# Altium schematic sheet 14_LMS1_RF_PA.SchDoc: LMS1 RF PA
size A3; Organization: Lime Microsystems; Address1: Surrey Tech Centre; Address2: Guildford GU2 7YG; Address3: Surrey; Address4: United Kingdom; Revision: v1.0; SheetNumber: 14; SheetTotal: 31
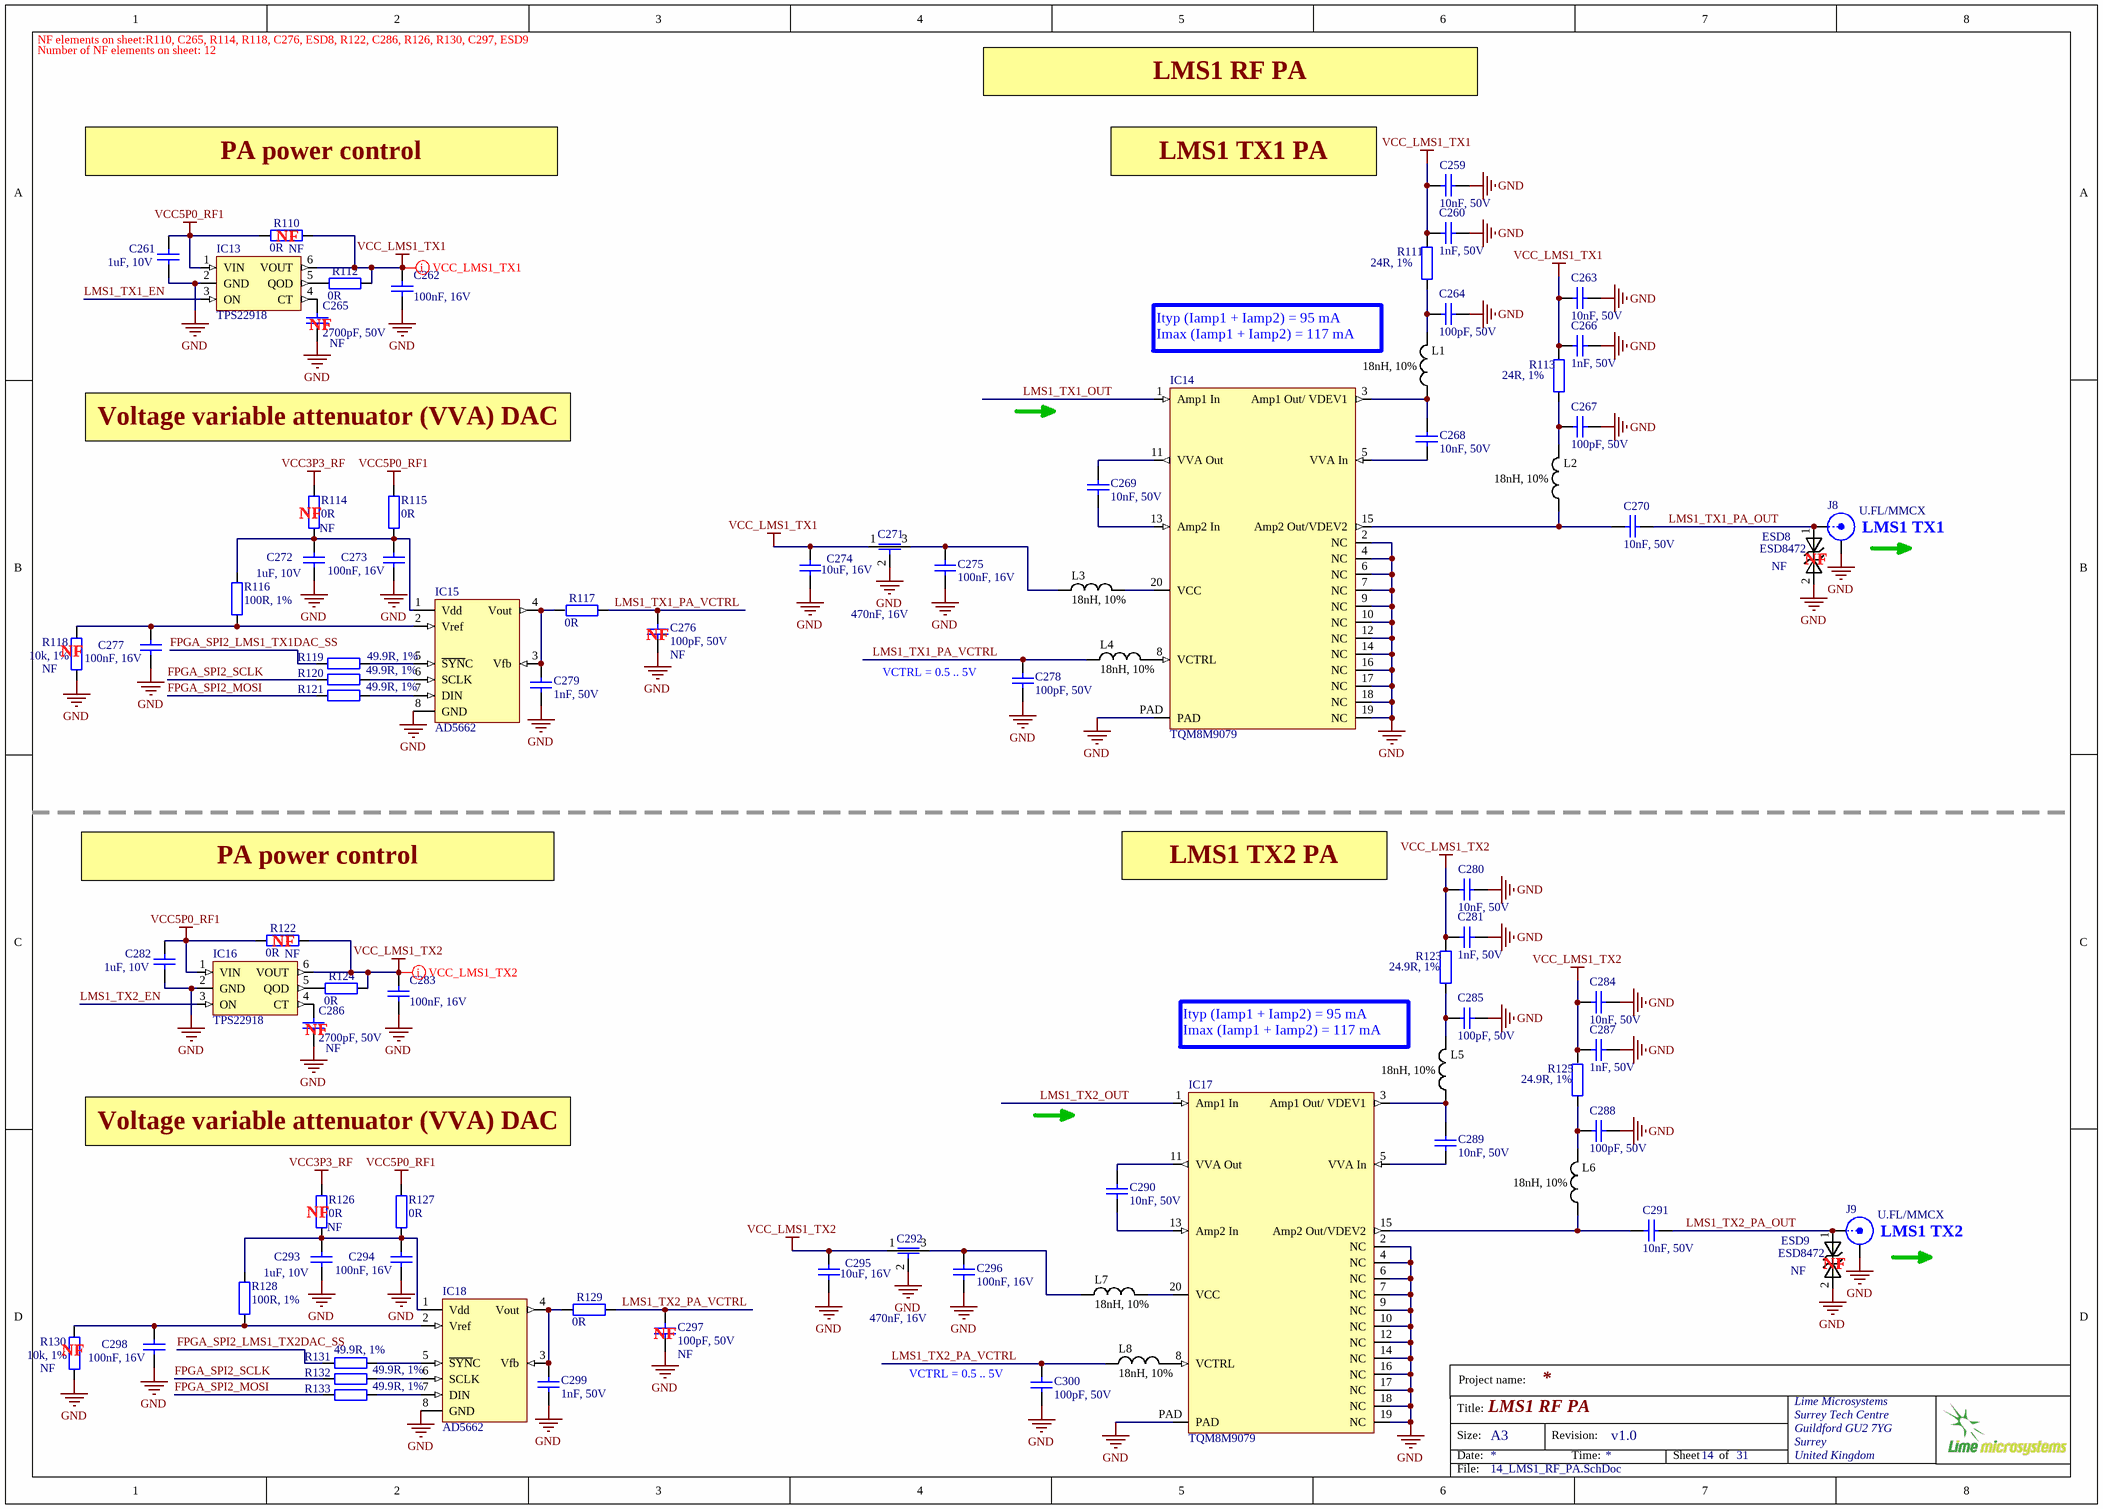
[diagram p0: 14_LMS1_RF_PA.SchDoc]

## Parts
C259  10nF, 50V  [CAP0402]
C260  1nF, 50V  [CAP0402]
C261  1uF, 10V  [CAP0402]
C262  100nF, 16V  [CAP0402]
C263  10nF, 50V  [CAP0402]
C264  100pF, 50V  [CAP0402]
C265  2700pF, 50V  Assembly Info: NF  [CAP0402]
C266  1nF, 50V  [CAP0402]
C267  100pF, 50V  [CAP0402]
C268  10nF, 50V  [CAP0402]
C269  10nF, 50V  [CAP0402]
C270  10nF, 50V  [CAP0402]
C271  470nF, 16V  [CAP0805_FEEDTHROUGH]
C272  1uF, 10V  [CAP0402]
C273  100nF, 16V  [CAP0402]
C274  10uF, 16V  [CAP0603]
C275  100nF, 16V  [CAP0402]
C276  100pF, 50V  Assembly Info: NF  [CAP0402]
C277  100nF, 16V  [CAP0402]
C278  100pF, 50V  [CAP0402]
C279  1nF, 50V  [CAP0402]
C280  10nF, 50V  [CAP0402]
C281  1nF, 50V  [CAP0402]
C282  1uF, 10V  [CAP0402]
C283  100nF, 16V  [CAP0402]
C284  10nF, 50V  [CAP0402]
C285  100pF, 50V  [CAP0402]
C286  2700pF, 50V  Assembly Info: NF  [CAP0402]
C287  1nF, 50V  [CAP0402]
C288  100pF, 50V  [CAP0402]
C289  10nF, 50V  [CAP0402]
C290  10nF, 50V  [CAP0402]
C291  10nF, 50V  [CAP0402]
C292  470nF, 16V  [CAP0805_FEEDTHROUGH]
C293  1uF, 10V  [CAP0402]
C294  100nF, 16V  [CAP0402]
C295  10uF, 16V  [CAP0603]
C296  100nF, 16V  [CAP0402]
C297  100pF, 50V  Assembly Info: NF  [CAP0402]
C298  100nF, 16V  [CAP0402]
C299  1nF, 50V  [CAP0402]
C300  100pF, 50V  [CAP0402]
ESD8  ESD8472  Assembly Info: NF  [ESD8472_X3DFN2]
ESD9  ESD8472  Assembly Info: NF  [ESD8472_X3DFN2]
IC13  TPS22918  [SOT23-6]
IC14  TQM8M9079  [TQM8M9079]
IC15  AD5662  [AD5662_SOT23-8]
IC16  TPS22918  [SOT23-6]
IC17  TQM8M9079  [TQM8M9079]
IC18  AD5662  [AD5662_SOT23-8]
J8  U.FL/MMCX  [MMCX_UFL_conn_m]
J9  U.FL/MMCX  [MMCX_UFL_conn_m]
L1  18nH, 10%  [RES0603]
L2  18nH, 10%  [RES0603]
L3  18nH, 10%  [RES0603]
L4  18nH, 10%  [RES0603]
L5  18nH, 10%  [RES0603]
L6  18nH, 10%  [RES0603]
L7  18nH, 10%  [RES0603]
L8  18nH, 10%  [RES0603]
R110  0R  Assembly Info: NF  [RES0402]
R111  24R, 1%  [RES0402]
R112  0R  [RES0402]
R113  24R, 1%  [RES0402]
R114  0R  Assembly Info: NF  [RES0402]
R115  0R  [RES0402]
R116  100R, 1%  [RES0402]
R117  0R  [RES0402]
R118  10k, 1%  Assembly Info: NF  [RES0402]
R119  49.9R, 1%  [RES0402]
R120  49.9R, 1%  [RES0402]
R121  49.9R, 1%  [RES0402]
R122  0R  Assembly Info: NF  [RES0402]
R123  24.9R, 1%  [RES0402]
R124  0R  [RES0402]
R125  24.9R, 1%  [RES0402]
R126  0R  Assembly Info: NF  [RES0402]
R127  0R  [RES0402]
R128  100R, 1%  [RES0402]
R129  0R  [RES0402]
R130  10k, 1%  Assembly Info: NF  [RES0402]
R131  49.9R, 1%  [RES0402]
R132  49.9R, 1%  [RES0402]
R133  49.9R, 1%  [RES0402]

## Nets
GND: C259.2 C260.1 C261.1 C262.1 C263.2 C264.1 C265.2 C266.1 C267.1 C271.2 C272.1 C273.2 C274.1 C275.2 C276.2 C277.2 C278.2 C279.2 C280.2 C281.1 C282.1 C283.1 C284.2 C285.1 C286.2 C287.1 C288.1 C292.2 C293.1 C294.2 C295.1 C296.2 C297.2 C298.2 C299.2 C300.2 ESD8.2 ESD9.2 IC13.2(GND) IC14.2(NC) IC14.4(NC) IC14.6(NC) IC14.7(NC) IC14.9(NC) IC14.10(NC) IC14.12(NC) IC14.14(NC) IC14.16(NC) IC14.17(NC) IC14.18(NC) IC14.19(NC) IC14.PAD IC15.8(GND) IC16.2(GND) IC17.2(NC) IC17.4(NC) IC17.6(NC) IC17.7(NC) IC17.9(NC) IC17.10(NC) IC17.12(NC) IC17.14(NC) IC17.16(NC) IC17.17(NC) IC17.18(NC) IC17.19(NC) IC17.PAD IC18.8(GND) J8.2(Y) J9.2(Y) R118.1 R130.1
VCC3P3_RF: R114.2 R126.2
VCC5P0_RF1: C261.2 C282.2 IC13.1(VIN) IC16.1(VIN) R110.2 R115.2 R122.2 R127.2
VCC_LMS1_TX1: C259.1 C260.2 C262.2 C263.1 C266.2 C271.1 C274.2 IC13.6(VOUT) R110.1 R111.2 R112.1 R113.2
VCC_LMS1_TX2: C280.1 C281.2 C283.2 C284.1 C287.2 C292.1 C295.2 IC16.6(VOUT) R122.1 R123.2 R124.1 R125.2
FPGA_SPI2_LMS1_TX1DAC_SS: R119.2
FPGA_SPI2_LMS1_TX2DAC_SS: R131.2
FPGA_SPI2_MOSI: R121.2 R133.2
FPGA_SPI2_SCLK: R120.2 R132.2
LMS1_TX1_EN: IC13.3(ON)
LMS1_TX1_OUT: IC14.1(Amp1_In)
LMS1_TX1_PA_OUT: C270.2 ESD8.1 J8.1(X)
LMS1_TX1_PA_VCTRL: C276.1 C278.1 L4.2 R117.1
LMS1_TX2_EN: IC16.3(ON)
LMS1_TX2_OUT: IC17.1(Amp1_In)
LMS1_TX2_PA_OUT: C291.2 ESD9.1 J9.1(X)
LMS1_TX2_PA_VCTRL: C297.1 C300.1 L8.2 R129.1
NetC264_2: C264.2 L1.1 R111.1
NetC265_1: C265.1 IC13.4(CT)
NetC267_2: C267.2 L2.1 R113.1
NetC268_1: C268.1 IC14.5(VVA_In)
NetC268_2: C268.2 IC14.3(Amp1_Out/_VDEV1) L1.2
NetC269_1: C269.1 IC14.13(Amp2_In)
NetC269_2: C269.2 IC14.11(VVA_Out)
NetC270_1: C270.1 IC14.15(Amp2_Out/VDEV2) L2.2
NetC271_3: C271.3 C275.1 L3.2
NetC272_2: C272.2 C273.1 IC15.1(Vdd) R114.1 R115.1 R116.1
NetC277_1: C277.1 IC15.2(Vref) R116.2 R118.2
NetC279_1: C279.1 IC15.3(Vfb) IC15.4(Vout) R117.2
NetC285_2: C285.2 L5.1 R123.1
NetC286_1: C286.1 IC16.4(CT)
NetC288_2: C288.2 L6.1 R125.1
NetC289_1: C289.1 IC17.5(VVA_In)
NetC289_2: C289.2 IC17.3(Amp1_Out/_VDEV1) L5.2
NetC290_1: C290.1 IC17.13(Amp2_In)
NetC290_2: C290.2 IC17.11(VVA_Out)
NetC291_1: C291.1 IC17.15(Amp2_Out/VDEV2) L6.2
NetC292_3: C292.3 C296.1 L7.2
NetC293_2: C293.2 C294.1 IC18.1(Vdd) R126.1 R127.1 R128.1
NetC298_1: C298.1 IC18.2(Vref) R128.2 R130.2
NetC299_1: C299.1 IC18.3(Vfb) IC18.4(Vout) R129.2
NetIC13_5: IC13.5(QOD) R112.2
NetIC14_8: IC14.8(VCTRL) L4.1
NetIC14_20: IC14.20(VCC) L3.1
NetIC15_5: IC15.5(~{SYN}C) R119.1
NetIC15_6: IC15.6(SCLK) R120.1
NetIC15_7: IC15.7(DIN) R121.1
NetIC16_5: IC16.5(QOD) R124.2
NetIC17_8: IC17.8(VCTRL) L8.1
NetIC17_20: IC17.20(VCC) L7.1
NetIC18_5: IC18.5(~{SYN}C) R131.1
NetIC18_6: IC18.6(SCLK) R132.1
NetIC18_7: IC18.7(DIN) R133.1

## Layout directives
net class VCC_LMS1_TX1: VCC_LMS1_TX1
net class VCC_LMS2_TX1_2: VCC_LMS1_TX2

## Notes on the sheet
- NF elements on sheet:R110, C265, R114, R118, C276, ESD8, R122, C286, R126, R130, C297, ESD9
- Number of NF elements on sheet: 12
- LMS1 RF PA
- PA power control
- LMS1 TX1 PA
- (near R110) NF
- (near C265) NF
- Ityp (Iamp1 + Iamp2) = 95 mA
  Imax (Iamp1 + Iamp2) = 117 mA
- Voltage variable attenuator (VVA) DAC
- (near R114) NF
- (near ESD8) NF
- (near J8) LMS1 TX1
- (near C276) NF
- (near R118) NF
- (near C278) VCTRL = 0.5 .. 5V
- LMS1 TX2 PA
- (near R122) NF
- (near C286) NF
- (near R126) NF
- (near J9) LMS1 TX2
- (near ESD9) NF
- (near R130) NF
- (near C297) NF
- (near C300) VCTRL = 0.5 .. 5V
- Project name:
- Title:
- Size:
- Date:
- A3
- Revision:
- Time:
- Sheet
- of
- File:

## Library data of the parts
C259 C263 C268-C270 C280 C284 C289-C291 = Cap_0402: Part Description: 10000pF ±10% 50V Ceramic Capacitor X7R 0402 (1005 Metric); Manufacturer: Murata Electronics North America; Manufacturer Part Number 1: GRM155R71H103KA88D; Tolerance: ±10%; Temperature Coefficient: X7R; Value: 10nF, 50V; Supplier 1: Digi-Key; Supplier Part Number 1: 490-4516-2-ND; RoHS: RoHS Compliant; Category: Capacitors; Stock 1: 10970000; Pricing 1: 10000=0.00185, 20000=0.00176, 30000=0.00167 (USD); Packaging: Tape & Reel (TR); Part Status: Active; Voltage - Rated: 50V; Operating Temperature: -55°C ~ 125°C; Features: -; Ratings: -; Applications: General Purpose; Mounting Type: Surface Mount, MLCC; Package / Case: 0402 (1005 Metric); Size / Dimension: 0.039" L x 0.020" W (1.00mm x 0.50mm); Height - Seated (Max): -; Thickness (Max): 0.022" (0.55mm); Lead Spacing: -; Lead Style: -; ComponentLink1URL: http://www.murata.com/~/media/webrenewal/support/library/catalog/products/capacitor/mlcc/c02e.ashx?la=en-us; ComponentLink1Description: http://www.murata.com/~/media/webrenewal/support/library/catalog/products/capacitor/mlcc/c02e.ashx?la=en-us
C260 C266 C281 C287 = Cap_0402: Manufacturer Part Number 1: GCM155R71H102KA37D; Part Description: 1000pF ±10% 50V X7R Ceramic Capacitor -55°C ~ 125°C Surface Mount, MLCC 0402 (1005 Metric) 0.039" L x 0.020" W (1.00mm x 0.50mm); Capacitance: 1000 pF; Type: Automotive Ultra Small MLCC; Tolerance: 10 %; Brand: Murata Electronics; Case Height: 0.5 mm; Case Length: 1 mm; Dielectric: X7R; Temperature Coefficient / Code: +/- 15 %; Value: 1nF, 50V; Supplier 1: Mouser; Supplier Part Number 1: 81-GCM155R71H102KA7D; Case Code - in: 0402; Package / Case: 0402 (1005 metric); Termination Style: SMD/SMT; Packaging: Reel; Operating Temperature Range: - 55 C to + 125 C; Maximum Operating Temperature: + 125 C; Manufacturer: Murata Electronics; Category: Multilayer Ceramic Capacitors MLCC - SMD/SMT; RoHS: RoHS Compliant; Series: GCM; Case Width: 0.5 mm; Voltage Rating DC: 50 V; Case Code - mm: 1005; Product: Automotive MLCCs; Standard Pack Qty: 10000; Reeling: True; RoHS - Mouser: Y; Minimum Order Quantity: 1; Product Category: Automotive Ceramic Chip Capacitors; Minimum Operating Temperature: - 55 C
C261 C272 C282 C293 = Cap_0402: Manufacturer Part Number 1: C1005X5R1E105K050BC; Manufacturer: TDK; Part Description: 1µF ±10% 10V X5R Ceramic Capacitor -55°C ~ 85°C Surface Mount, MLCC 0402 (1005 Metric) 0.039" L x 0.020" W (1.00mm x 0.50mm); Voltage Rating: 10; Capacitance Tolerance: ± 10%; Product Range: TDK - C Series; Ceramic Capacitor Case: 0402 [1005 Metric]; Capacitance: 1; Dielectric Characteristic: X6; Value: 1uF, 10V; Supplier 1: Digi-Key; Supplier Part Number 1: 445-9066-1-ND; MSL: -; RoHS: YES
C262 C275 C283 C296 = Cap_0402: Manufacturer: Murata Electronics; Manufacturer Part Number 1: GRM155R71C104KA88D; Part Description: 0.10µF ±10% 16V X7R Ceramic Capacitor -55°C ~ 125°C Surface Mount, MLCC 0402 (1005 Metric) 0.039" L x 0.020" W (1.00mm x 0.50mm); Tolerance: 10 %; Type: General Purpose MLCC; Capacitance: 0.1 uF; Case Length: 1 mm; Dielectric: X7R; Case Height: 0.5 mm; Temperature Coefficient / Code: +/- 15 %; Value: 100nF, 16V; Supplier 1: Mouser; Supplier Part Number 1: 81-GRM155R71C104KA88; Case Code - in: 0402; RoHS: RoHS Compliant; Operating Temperature Range: - 55 C to + 125 C; Series: GRM; Termination Style: SMD/SMT; Package / Case: 0402 (1005 metric); Voltage Rating DC: 16 V; Maximum Operating Temperature: + 125 C; Case Code - mm: 1005; Minimum Operating Temperature: - 55 C; Product Category: Low & Medium Capacitance SMD Ceramic Chip Capacitors; Packaging: Reel; Product: General Type MLCCs; Category: Multilayer Ceramic Capacitors MLCC - SMD/SMT; Brand: Murata Electronics; Case Width: 0.5 mm; RoHS - Mouser: Y; Standard Pack Qty: 10000; Minimum Order Quantity: 1; Reeling: True
C264 C267 C276 C278 C285 C288 C297 C300 = Cap_0402: Manufacturer Part Number 1: CC0402JRNPO9BN101; Manufacturer: Yageo; Part Description: 100pF ±5% 50V C0G, NP0 Ceramic Capacitor -55°C ~ 125°C Surface Mount, MLCC 0402 (1005 Metric) 0.039" L x 0.020" W (1.00mm x 0.50mm); Tolerance: ±5%; Temperature Coefficient: C0G, NP0; Value: 100pF, 50V; Capacitance: 100pF; Thickness (Max): 0.022" (0.55mm); Size / Dimension: 0.039" L x 0.020" W (1.00mm x 0.50mm); RoHS: RoHS Compliant; Ratings: -; Package / Case: 0402 (1005 Metric); Mounting Type: Surface Mount, MLCC; Height - Seated (Max): -; Features: -; Lead Spacing: -; Voltage - Rated: 50V; Operating Temperature: -55°C ~ 125°C; Packaging: Cut Tape (CT); Applications: General Purpose; Lead Style: -; Supplier 1: Digi-Key; Category: Capacitors; Supplier Part Number 1: 311-1024-1-ND
C265 C286 = Cap_0402: Manufacturer Part Number 1: GRM155R71H272KA01J; Manufacturer: Murata Electronics North America; Part Description: 2700pF ±10% 50V Ceramic Capacitor X7R 0402 (1005 Metric); Notification: Current market demand for these product types have resulted in fluctuating and extending lead times. Lead times may differ.; Tolerance: ±10%; Temperature Coefficient: X7R; Value: 2700pF, 50V; Size / Dimension: 0.039" L x 0.020" W (1.00mm x 0.50mm); Supplier 1: Digi-Key; Height - Seated (Max): -; Package / Case: 0402 (1005 Metric); Supplier Part Number 1: 490-6361-1-ND; Part Status: Active; RoHS: RoHS Compliant; Operating Temperature: -55°C ~ 125°C; Category: Capacitors; Ratings: -; Features: -; Packaging: Cut Tape (CT); Mounting Type: Surface Mount, MLCC; Voltage - Rated: 50V; Lead Spacing: -; Thickness (Max): 0.022" (0.55mm); Applications: General Purpose
C271 C292 = Cap_feed_through: Part Description: 0.47µF Feed Through Capacitor 16V 2A 30mOhm 0805 (2012 Metric), 3 PC Pad; Manufacturer: Murata; Manufacturer Part Number 1: NFM21PC474R1C3D; Max Current Rating: 2A; Tolerance: 20%; DC Resistance (DCR): 30mR; Insulation Resistance: 1GR; Value: 470nF, 16V; Supplier 1: Digi-Key; Supplier Part Number 1: 490-2537-1-ND; Stock 1: 220606; Pricing 1: 1=0,25000, 10=0,22900, 25=0,21840, 50=0,21160, 100=0,20450, 250=0,19392, 500=0,16218, 1000=0,12586 (USD); Mount: Surface Mount,PCB; Case/Package: 0805; Weight: 0.000194oz; Case Code (Metric): 2012; Case Code (Imperial): 0805; Min Operating Temperature: -55°C; Max Operating Temperature: 125°C; Package Quantity: 1; Capacitance: 470nF; Packaging: Tape and Reel; Max Voltage Rating (DC): 16V; Current Rating: 2A; Voltage Rating: 16V; Voltage Rating (DC): 16V; Voltage: 16V; Current: 2A; Termination: Flat; Length: 2mm; Height: 0.85mm; Width: 1.25mm; Depth: 1.25mm; Radiation Hardening: No; REACH SVHC: No SVHC; Lead Free: Lead Free; RoHS: Yes
C273 C277 C294 C298 = Cap_0603: Manufacturer Part Number 1: GRM155R71C104KA88D; Part Description: 0.10µF ±10% 16V X7R Ceramic Capacitor -55°C ~ 125°C Surface Mount, MLCC 0402 (1005 Metric) 0.039" L x 0.020" W (1.00mm x 0.50mm); Brand: Murata Electronics; Tolerance: 10 %; Type: General Purpose MLCC; Capacitance: 0.1 uF; Temperature Coefficient / Code: +/- 15 %; Case Height: 0.5 mm; Case Length: 1 mm; Dielectric: X7R; Supplier 1: Mouser; Supplier Part Number 1: 81-GRM155R71C104KA88; Case Code - in: 0402; Manufacturer: Murata Electronics; Category: Multilayer Ceramic Capacitors MLCC - SMD/SMT; Voltage Rating DC: 16 V; Value: 100nF, 16V; Case Code - mm: 1005; Case Width: 0.5 mm; Maximum Operating Temperature: + 125 C; Minimum Operating Temperature: - 55 C; Minimum Order Quantity: 1; Operating Temperature Range: - 55 C to + 125 C; Package / Case: 0402 (1005 metric); Packaging: Reel; Product: General Type MLCCs; Product Category: Low & Medium Capacitance SMD Ceramic Chip Capacitors; Reeling: True; RoHS - Mouser: Y; RoHS: RoHS Compliant; Series: GRM; Standard Pack Qty: 10000; Termination Style: SMD/SMT
C274 C295 = Cap_0603: Manufacturer: Yageo; Manufacturer Part Number 1: GRM188R61C106MA73D; Part Description: 10µF ±20% 16V Ceramic Capacitor X5R 0603 (1608 Metric); Temperature Coefficient: X5R; Capacitance: 10µF; Tolerance: ±20%; Value: 10uF, 16V; Supplier 1: Digi-Key; Supplier Part Number 1: 490-7201-2-ND; Category: Capacitors; Ratings: -; Features: -; Lead Style: -; Package / Case: 0603 (1608 Metric); Lead Spacing: -; Applications: General Purpose; Voltage - Rated: 16V; Operating Temperature: -55°C ~ 85°C; Thickness (Max): 0.039" (1.00mm); Mounting Type: Surface Mount, MLCC; RoHS: RoHS Compliant; Size / Dimension: 0.063" L x 0.031" W (1.60mm x 0.80mm); Packaging: Tape & Reel (TR); Height - Seated (Max): -
C279 C299 = Cap_0402: Manufacturer Part Number 1: GCM155R71H102KA37D; Manufacturer: Murata Electronics; Part Description: 1000pF ±10% 50V X7R Ceramic Capacitor -55°C ~ 125°C Surface Mount, MLCC 0402 (1005 Metric) 0.039" L x 0.020" W (1.00mm x 0.50mm); Capacitance: 1000 pF; Tolerance: 10 %; Dielectric: X7R; Case Height: 0.5 mm; Case Length: 1 mm; Temperature Coefficient / Code: +/- 15 %; Type: Automotive Ultra Small MLCC; Value: 1nF, 50V; Supplier 1: Mouser; Supplier Part Number 1: 81-GCM155R71H102KA7D; Packaging: Reel; Brand: Murata Electronics; Case Code - in: 0402; Case Code - mm: 1005; Case Width: 0.5 mm; Category: Multilayer Ceramic Capacitors MLCC - SMD/SMT; Maximum Operating Temperature: + 125 C; Minimum Operating Temperature: - 55 C; Minimum Order Quantity: 1; Operating Temperature Range: - 55 C to + 125 C; Package / Case: 0402 (1005 metric); Product: Automotive MLCCs; Product Category: Automotive Ceramic Chip Capacitors; Reeling: True; RoHS - Mouser: Y; RoHS: RoHS Compliant; Series: GCM; Standard Pack Qty: 10000; Termination Style: SMD/SMT; Voltage Rating DC: 50 V
ESD8 ESD9 = ESD8472: Manufacturer: ON Semiconductor; Manufacturer Part Number 1: ESD8472MUT5G; Part Description: TVS DIODE 5.3VWM 14VC X3DFN2; Voltage - Reverse Standoff (Typ): 5.3V (Max); Voltage - Breakdown (Min): 7V; Voltage - Clamping (Max) @ Ipp: 14V; Current - Peak Pulse (10/1000µs): 3A (8/20µs); Power Line Protection: No; Capacitance @ Frequency: 0.2pF @ 1MHz; Supplier 1: Digi-Key; RoHS: RoHS Compliant; Category: Circuit Protection; Stock 1: 2295; Pricing 1: 1=0.39, 10=0.315, 100=0.2142, 500=0.16068, 1000=0.12051 (USD); Packaging: Cut Tape (CT); Part Status: Active; Type: Zener; Power - Peak Pulse: -; Applications: Automotive, RF Antenna; Operating Temperature: -55°C ~ 150°C (TJ); Mounting Type: Surface Mount; Package / Case: 2-XFDFN; Supplier Device Package: 2-X3DFN (0.62x0.32); ComponentLink1URL: http://www.onsemi.com/pub/Collateral/ESD8472-D.PDF; ComponentLink1Description: http://www.onsemi.com/pub/Collateral/ESD8472-D.PDF; Supplier Part Number 1: ESD8472MUT5GOSCT-ND
IC13 IC16 = TPS22918: Part Description: IC PWR DIST SWITCH SNGL SOT23-6; Manufacturer: Texas Instruments; Manufacturer Part Number 1: TPS22918DBVT; Switch Type: General Purpose; Number of Outputs: 1; Ratio - Input:Output: 1:1; Output Configuration: High Side; Output Type: N-Channel; Interface: On/Off; Voltage - Load: 1 V ~ 5.5 V; Voltage - Supply (Vcc/Vdd): Not Required; Current - Output (Max): 2A; Rds On (Typ): 53 mOhm; Input Type: Non-Inverting; Supplier 1: Digi-Key; RoHS: RoHS Compliant; Category: Integrated Circuits (ICs); Stock 1: 16592; Pricing 1: 1=0.63, 10=0.551, 100=0.4222 (USD); Packaging: Digi-Reel®; Part Status: Active; Features: Load Discharge, Slew Rate Controlled; Fault Protection: -; Operating Temperature: -40°C ~ 105°C (TA); Package / Case: SOT-23-6; Supplier Device Package: SOT-23-6; ComponentLink1URL: http://www.ti.com/lit/ds/symlink/tps22918.pdf; ComponentLink1Description: http://www.ti.com/lit/ds/symlink/tps22918.pdf; Supplier Part Number 1: 296-44073-6-ND
IC14 IC17 = TQM8M9079: Part Description: RF Amplifier 500-2700MHz NF 4dB Gain 38dB Attn. 30dB; Manufacturer: Qorvo; Manufacturer Part Number 1: TQM8M9079; Supplier Part Number 1: 772-TQM8M9079; Supplier 1: Mouser
IC15 IC18 = AD5662: Manufacturer: Analog Devices Inc.; Manufacturer Part Number 1: AD5662BRJZ-2REEL7; Part Description: IC DAC 16BIT BUFF V-OUT SOT23-8; Number of Bits: 16; Number of D/A Converters: 1; Settling Time: 10µs; Output Type: Voltage - Buffered; Differential Output: No; Data Interface: SPI, DSP; Reference Type: External; Voltage - Supply, Analog: 2.7 V ~ 5.5 V; INL/DNL (LSB): ±8, ±1 (Max); Architecture: String DAC; Supplier 1: Digi-Key; RoHS: RoHS Compliant; Category: Integrated Circuits (ICs); Stock 1: 2784; Pricing 1: 1=7.55, 10=6.821, 100=5.6469, 500=4.91722, 1000=4.28274 (USD); Packaging: Cut Tape (CT); Part Status: Active; Voltage - Supply, Digital: 2.7 V ~ 5.5 V; Operating Temperature: -40°C ~ 125°C; Package / Case: SOT-23-8; Supplier Device Package: SOT-23-8; ComponentLink1URL: http://www.analog.com/media/en/technical-documentation/data-sheets/AD5662.pdf; ComponentLink1Description: http://www.analog.com/media/en/technical-documentation/data-sheets/AD5662.pdf; Supplier Part Number 1: AD5662BRJZ-2REEL7CT-ND
J8 J9 = RF_IF_connector: CONN UMC RCPT STR 50 OHM SMD; Manufacturer: Amphenol RF; Manufacturer Part Number 1: 908-22101T; Part Description: MMCX Connector Jack, Female Socket 50Ohm Surface Mount Solder; Body Material: Copper,Brass; Center Contact Plating: Gold; Connector Type: MMCX,Coaxial; Dielectric Material: Polymer; Impedance: 50R; Frequency: 6GHz; Gender: Female; Insulation Resistance: 500MR; Mating Cycles: 500; Operating Frequency: 0 to 6 GHz; Polarity: Standard; Fastening Type: SNAP-ON; Housing Color: Black; Packaging: Tape and Reel; RoHS: Yes; Supplier 1: Digi-Key; Supplier Part Number 1: ARF1725CT-ND; Body Plating: Gold; Case/Package: 908; ComponentLink1Description: https://datasheet.ciiva.com/5177/c908-22101t-37976-5177328.pdf?src-supplier=Mouser; ComponentLink1URL: https://datasheet.ciiva.com/5177/c908-22101t-37976-5177328.pdf?src-supplier=Mouser; ComponentLink2Description: https://datasheet.ciiva.com/643/c908-22101t-643558.pdf?src-supplier=Digi-Key; ComponentLink2URL: https://datasheet.ciiva.com/643/c908-22101t-643558.pdf?src-supplier=Digi-Key; ComponentLink3Description: https://datasheet.ciiva.com/7662/1636995-7662651.pdf?src-supplier=Element14; ComponentLink3URL: https://datasheet.ciiva.com/7662/1636995-7662651.pdf?src-supplier=Element14; ComponentLink4Description: https://datasheet.ciiva.com/5689/c908-22101t-5689787.pdf?src-supplier=Farnell; ComponentLink4URL: https://datasheet.ciiva.com/5689/c908-22101t-5689787.pdf?src-supplier=Farnell; ComponentLink5Description: https://datasheet.ciiva.com/7996/691284-7996807.pdf?src-supplier=Element14; ComponentLink5URL: https://datasheet.ciiva.com/7996/691284-7996807.pdf?src-supplier=Element14; ComponentLink6Description: https://datasheet.ciiva.com/643/c908-22101t-643559.pdf?src-supplier=Digi-Key; ComponentLink6URL: https://datasheet.ciiva.com/643/c908-22101t-643559.pdf?src-supplier=Digi-Key; ComponentLink7Description: https://datasheet.ciiva.com/643/c908-22101t-643560.pdf?src-supplier=Digi-Key; ComponentLink7URL: https://datasheet.ciiva.com/643/c908-22101t-643560.pdf?src-supplier=Digi-Key; Contact Material: Copper; Contact Plating: Gold; Depth: 4.32mm; Insulation Material: Polymer; Length: 4.32mm; Max Frequency: 6GHz; Max Operating Temperature: 155°C; Min Operating Temperature: -40°C; Mount: Surface Mount,PCB; Orientation: Straight; Package Quantity: 1; Plating: Gold; Pricing 1: 1=6,18000, 10=5,60700, 25=5,31040, 50=5,18700, 100=4,94000, 250=4,32248, 500=4,19900 (USD); Radiation Hardening: No; REACH SVHC: Unknown; Series: MicroMate™; Stock 1: 6928; Termination: Solder
L1-L8 = Inductor: Part Description: 18nH Unshielded Wirewound Inductor 700mA 170 mOhm Max 0603 (1608 Metric); Manufacturer: Pulse Electronics Network; Manufacturer Part Number 1: PE-0603CD180KTT; Type: Wirewound; Material - Core: Ceramic; Shielding: Unshielded; DC Resistance (DCR): 170 mOhm Max; Q @ Freq: 35 @ 180MHz; Value: 18nH, 10%; Supplier 1: Digi-Key; Supplier Part Number 1: 1840-1105-1-ND; RoHS: RoHS Compliant; Category: Inductors, Coils, Chokes; Stock 1: 14000; Pricing 1: 1=0.41, 10=0.368, 100=0.253, 500=0.2162, 1000=0.1656 (USD); Packaging: Cut Tape (CT); Part Status: Active; Tolerance: ±10%; Ratings: -; Operating Temperature: -40°C ~ 125°C; Mounting Type: Surface Mount; Package / Case: 0603 (1608 Metric); Supplier Device Package: 0603 (1608 Metric); Size / Dimension: 0.071" L x 0.049" W (1.80mm x 1.24mm); Height - Seated (Max): 0.040" (1.02mm); ComponentLink1URL: http://productfinder.pulseeng.com/products/datasheets/WC701.pdf; ComponentLink1Description: http://productfinder.pulseeng.com/products/datasheets/WC701.pdf
R110 R112 R117 R122 R124 R129 = Res_0402: Manufacturer Part Number 1: RC0402JR-070RL; Manufacturer: Yageo; Part Description: RES SMD 0.0OHM JUMPER 1/16W 0402; Resistance (Ohms): 0.0; Tolerance: Jumper; Power (Watts): 0.063W, 1/16W; Value: 0R; Supplier 1: Digi-Key; Supplier Part Number 1: 311-0.0JRTR-ND; Category: Resistors; Temperature Coefficient: -; Features: Moisture Resistant; Supplier Device Package: 0402; Height: 0.016" (0.40mm); Package / Case: 0402 (1005 Metric); Operating Temperature: -55°C ~ 155°C; Size / Dimension: 0.039" L x 0.020" W (1.00mm x 0.50mm); Composition: Thick Film; Packaging: Tape & Reel (TR); Number of Terminations: 2; RoHS: RoHS Compliant
R111 R113 = Res_0402: Manufacturer: Yageo; Manufacturer Part Number 1: AC0402FR-0724RL; Part Description: 24 Ohms ±1% 0.063W, 1/16W Chip Resistor 0402 (1005 Metric) Automotive AEC-Q200, Moisture Resistant Thick Film; Max Power Dissipation: 63mW; Temperature Coefficient: 100ppm/°C; Value: 24R, 1%; Supplier 1: Digi-Key; Supplier Part Number 1: 13-AC0402FR-0724RLCT-ND; Stock 1: 14420; Pricing 1: 1=0.1, 10=0.022, 100=0.009, 1000=0.00402, 2500=0.00349, 5000=0.00288 (USD); Case/Package: 0402; Min Operating Temperature: -55°C; Max Operating Temperature: 155°C; Packaging: Tape and Reel; Resistance: 24R; Resistor Type: Thick Film; Number of Terminations: 2; Tolerance: 1%; Features: Moisture Resistant,Automotive AEC-Q200; Length: 0.039inch; Width: 0.02inch; Height: 0.015inch; RoHS Compliant: Yes; ComponentLink1URL: http://www.yageo.com/NewPortal/yageodocoutput?fileName=/pdf/R-Chip/PYu-AC_51_RoHS_L_6.pdf&src-supplier=Digi-Key; ComponentLink1Description: http://www.yageo.com/NewPortal/yageodocoutput?fileName=/pdf/R-Chip/PYu-AC_51_RoHS_L_6.pdf&src-supplier=Digi-Key
R114 R115 R126 R127 = Res_0402: Manufacturer: Yageo; Part Description: RES SMD 0.0OHM JUMPER 1/16W 0402; Manufacturer Part Number 1: RC0402JR-070RL; Supplier 1: Digi-Key; Supplier Part Number 1: 311-0.0JRTR-ND; Composition: Thick Film; Package / Case: 0402 (1005 Metric); Category: Resistors; Value: 0R
R116 R128 = Res_0402: Manufacturer Part Number 1: RMCF0402FT100R; Manufacturer: Stackpole Electronics Inc.; Part Description: RES SMD 100 OHM 1% 1/16W 0402; Power (Watts): 0.063W, 1/16W; Temperature Coefficient: ±100ppm/°C; Resistance (Ohms): 100; Value: 100R, 1%; Supplier 1: Digi-Key; Supplier Part Number 1: RMCF0402FT100RDKR-ND; Packaging: Digi-Reel®; Composition: Thick Film; Number of Terminations: 2; Package / Case: 0402 (1005 Metric); RoHS: RoHS Compliant; Category: Resistors; Size / Dimension: 0.039" L x 0.020" W (1.00mm x 0.50mm); Tolerance: ±1%; Supplier Device Package: 0402; Features: -; Height: 0.016" (0.40mm); Operating Temperature: -55°C ~ 155°C
R118 R130 = Res_0402: Manufacturer: Yageo; Manufacturer Part Number 1: RC0402FR-0710KL; Part Description: RES SMD 10K OHM 1% 1/16W 0402; Temperature Coefficient: ±100ppm/°C; Power (Watts): 0.063W, 1/16W; Value: 10k, 1%; Supplier 1: Digi-Key; Supplier Part Number 1: 311-10.0KLRTR-ND; Resistance (Ohms): 10k; Packaging: Tape & Reel (TR); RoHS: RoHS Compliant; Package / Case: 0402 (1005 Metric); Tolerance: ±1%; Operating Temperature: -55°C ~ 155°C; Size / Dimension: 0.039" L x 0.020" W (1.00mm x 0.50mm); Number of Terminations: 2; Category: Resistors; Height: 0.016" (0.40mm); Supplier Device Package: 0402; Features: Moisture Resistant; Composition: Thick Film
R119-R121 R131-R133 = Res_0402: Manufacturer: Samsung Electro-Mechanics America, Inc.; Part Description: RES SMD 49.9 OHM 1% 1/16W 0402; Manufacturer Part Number 1: RC1005F49R9CS; Temperature Coefficient: ±100ppm/°C; Resistance (Ohms): 49.9; Power (Watts): 0.063W, 1/16W; Number of Terminations: 2; Size / Dimension: 0.039" L x 0.020" W (1.00mm x 0.50mm); Supplier Device Package: 0402 (1005 Metric); RoHS: RoHS Compliant; Supplier Part Number 1: 1276-3469-6-ND; Features: -; Packaging: Digi-Reel®; Tolerance: ±1%; Height: 0.016" (0.40mm); Category: Resistors; Composition: Thick Film; Package / Case: 0402 (1005 Metric); Supplier 1: Digi-Key; Operating Temperature: -55°C ~ 155°C; Value: 49.9R, 1%
R123 R125 = Res_0402: Manufacturer: Vishay Dale; Part Description: RES SMD 24.9 OHM 1% 1/16W 0402; Manufacturer Part Number 1: CRCW040224R9FKED; Power (Watts): 0.063W, 1/16W; Temperature Coefficient: ±100ppm/°C; Resistance (Ohms): 24.9; Value: 24.9R, 1%; Category: Resistors; Supplier Device Package: 0402 (1005 Metric); Size / Dimension: 0.039" L x 0.020" W (1.00mm x 0.50mm); Number of Terminations: 2; Height: 0.016" (0.40mm); Packaging: Cut Tape (CT); Package / Case: 0402 (1005 Metric); Tolerance: ±1%; Operating Temperature: -55°C ~ 155°C; Composition: Thick Film; Supplier Part Number 1: 541-24.9LCT-ND; Features: Automotive AEC-Q200; Supplier 1: Digi-Key; RoHS: RoHS Compliant